# Altium schematic sheet Sheet1.SchDoc
size A; SheetNumber: 1; SheetTotal: 1; SPICEModelCacheGMJYVSQW: <root> / <DocumentId>GMJYVSQW</DocumentId> / <CacheFrame Number="0"> / <Model Name="cap" Kind="MDL"> / <Text>*Default semiconductor capacitor / .MODEL CAP C()</Text> / </Model> / </CacheFrame> / </root>
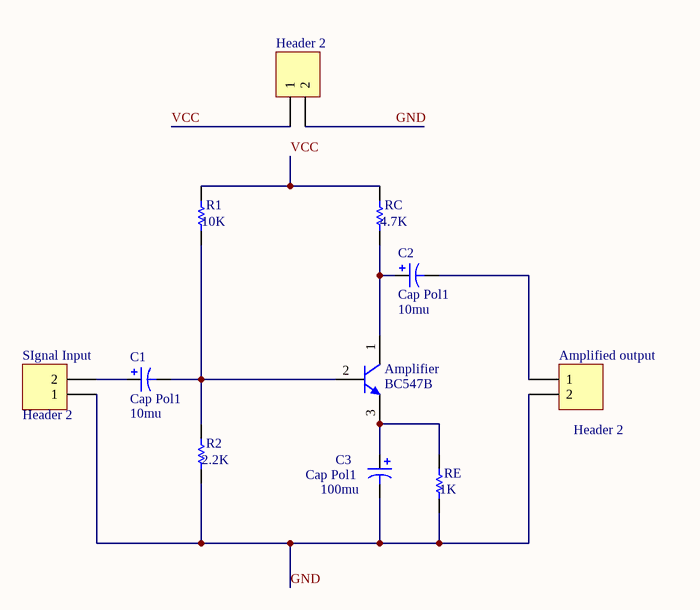
[diagram p0: Sheet1.SchDoc]

## Parts
?  Header 2  [HDR1X2]
Amplified_output  Header 2  [HDR1X2]
Amplifier  BC547B  [ONSC-TO-92-3-29-11]
C1  Cap Pol1  value 10mu  [RB7.6-15]
C2  Cap Pol1  value 10mu  [RB7.6-15]
C3  Cap Pol1  value 100mu  [RB7.6-15]
R1  value 10K  [AXIAL-0.3]
R2  value 2.2K  [AXIAL-0.3]
RC  value 4.7K  [AXIAL-0.3]
RE  value 1K  [AXIAL-0.3]
SIgnal_Input  Header 2  [HDR1X2]

## Nets
GND: ?.2 Amplified_output.2 C3.2 R2.1 RE.1 SIgnal_Input.1
VCC: ?.1 R1.2 RC.2
NetAmplified_output_1: Amplified_output.1 C2.2
NetAmplifier_1: Amplifier.1(C) C2.1 RC.1
NetAmplifier_2: Amplifier.2(B) C1.2 R1.1 R2.2
NetAmplifier_3: Amplifier.3(E) C3.1 RE.2
NetC1_1: C1.1 SIgnal_Input.2

## Library data of the parts
? Amplified_output SIgnal_Input = Header 2: Header, 2-Pin; LatestRevisionDate: 17-Jul-2002; LatestRevisionNote: Re-released for DXP Platform.; Publisher: Altium Limited
Amplifier = CMP-1048-01467-1: Amplifier Transistor, NPN Silicon, 3-Pin TO-92, Bulk Box; Manufacturer: On Semiconductor; IC Continuous (A): 0.1; fT Min (MHz): 150; DatasheetVersion: Rev. 7; ComponentLink1URL: http://www.onsemi.com/; Polarity: NPN; RoHS: FALSE; ComponentLink1Description: Manufacturer URL; Packing: Bulk Box; PackageDescription: 3-Pin Transistor Outline, Body 4.825 x 3.685 mm, Pitch 1.27 mm; ComponentLink3URL: http://www.onsemi.cn/pub_link/Collateral/2N6426-D.PDF; ComponentLink2Description: Datasheet; PackageVersion: Rev. AM; PackageReference: TO-92-3-29-11_AM_SL; ComponentLink3Description: Package Specification; Mounting Technology: Through Hole; PartNumber: BC547B; ComponentLink2URL: http://www.onsemi.com/pub_link/Collateral/BC546-D.PDF
C1-C3 = Cap Pol1: Polarized Capacitor (Radial); Published: 8-Jun-2000; LatestRevisionDate: 17-Jul-2002; LatestRevisionNote: Re-released for DXP Platform.; PackageReference: RB7.6-15; Publisher: Altium Limited; PackageDescription: Polarized Capacitor (Radial); 2 Leads
R1 R2 RC RE = Res1: Resistor; Published: 8-Jun-2000; LatestRevisionDate: 17-Jul-2002; LatestRevisionNote: Re-released for DXP Platform.; PackageReference: AXIAL-0.3; Publisher: Altium Limited; PackageDescription: Axial Device, Thru-Hole; 2 Leads; 0.3 in Pin Spacing